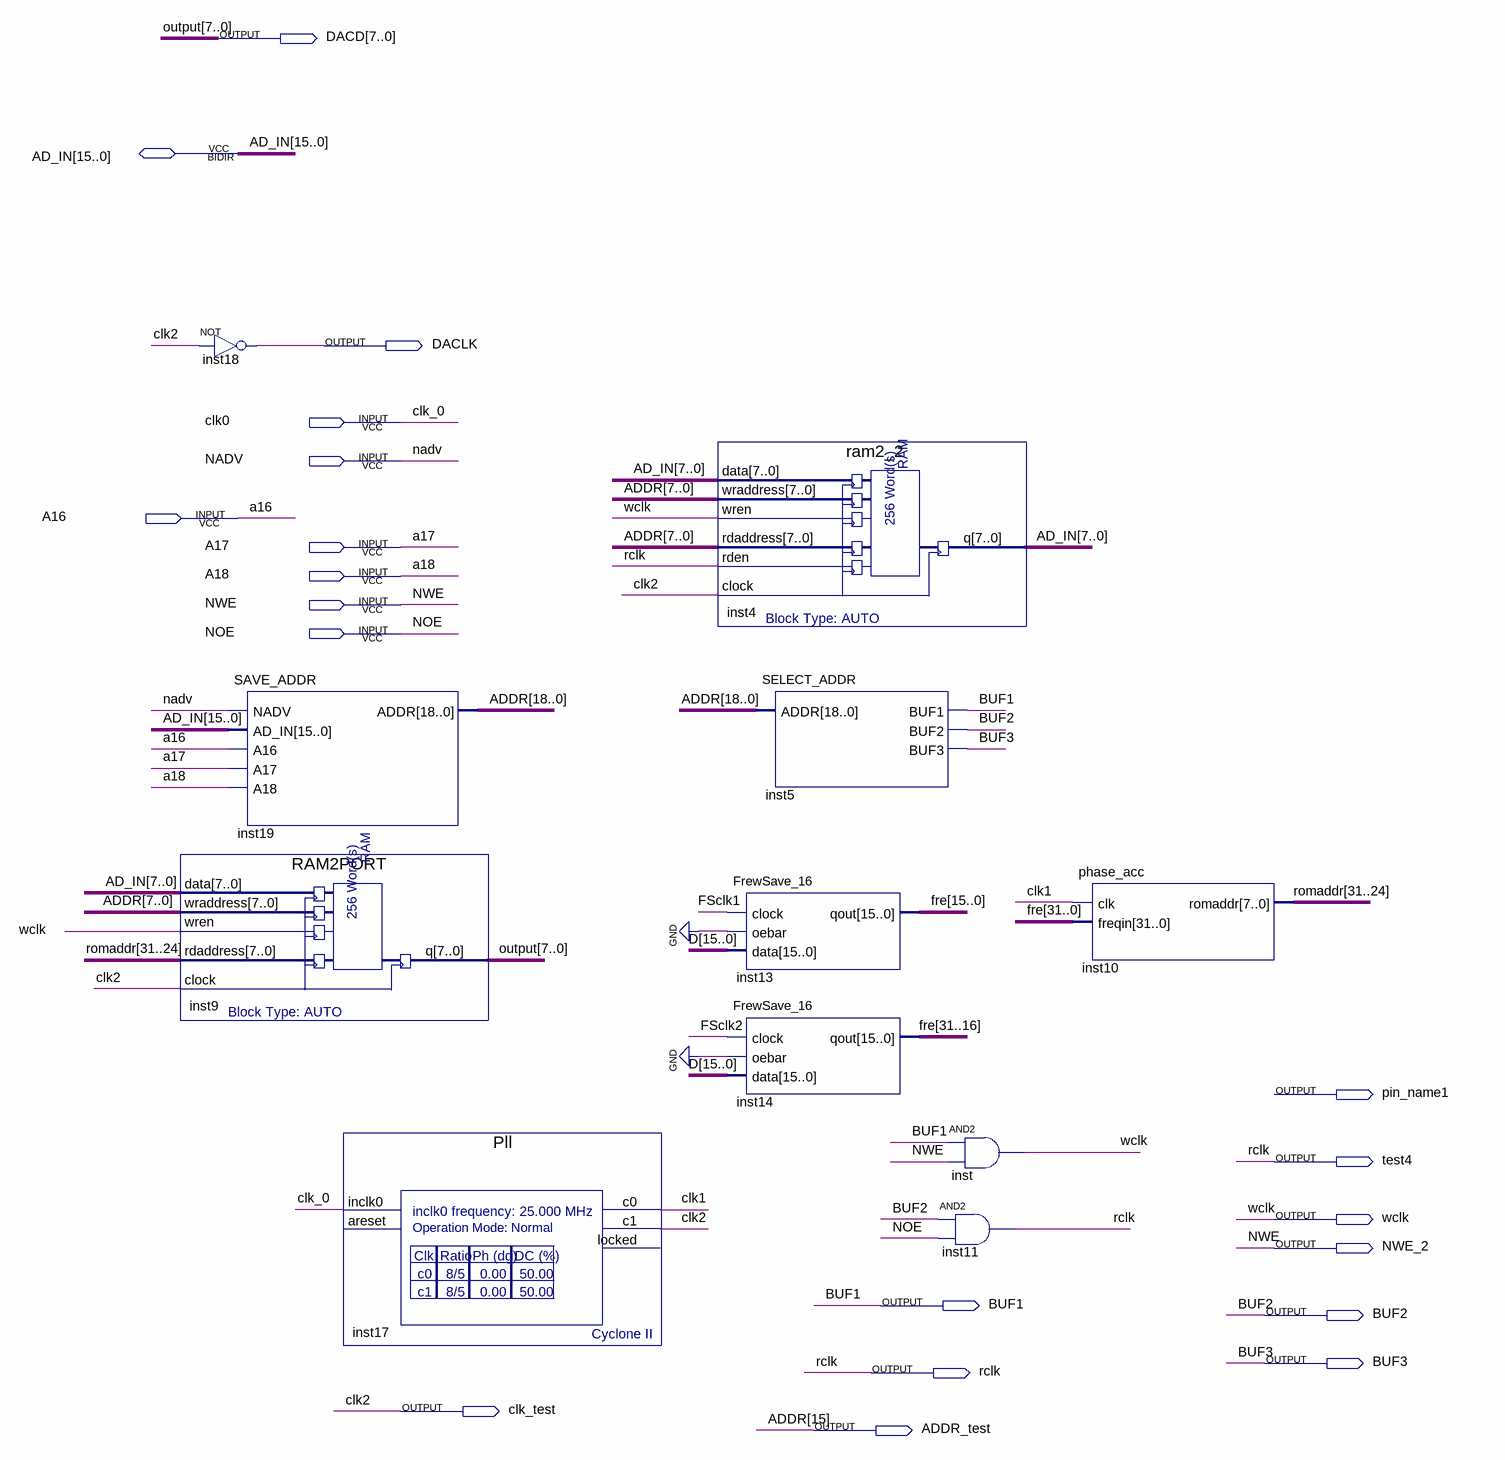
[diagram p0: schematic sheet]
// Quartus schematic dds_stm32.bdf as structural Verilog: 11 symbols, 20 pins
module dds_stm32 (
  input  clk0,
  input  NADV,
  input  A16,
  input  A17,
  input  A18,
  input  NWE,
  input  NOE,
  inout  [15:0] AD_IN,
  output [7:0] DACD,
  output DACLK,
  output pin_name1,
  output test4,
  output wclk,
  output NWE_2,
  output BUF1,
  output BUF2,
  output BUF3,
  output rclk,
  output clk_test,
  output ADDR_test
);

  wire clk1, FSclk1, FSclk2;
  wire [15:0] D;
  wire [18:0] ADDR;
  wire [31:0] fre;
  wire [31:24] romaddr;

  RAM2PORT inst9 (
    .data(AD_IN[7:0]), .wraddress(ADDR[7:0]), .wren(wclk), .rdaddress(romaddr), .clock(clk_test), .q(DACD));
  not inst18 (DACLK, clk_test);
  SAVE_ADDR inst19 (
    .NADV(NADV), .AD_IN(AD_IN), .A16(A16), .A17(A17), .A18(A18), .ADDR({ADDR[18:16], ADDR_test, ADDR[14:0]}));
  Pll inst17 (.inclk0(clk0), .c0(clk1), .c1(clk_test));  // open: areset, locked
  ram2_2 inst4 (
    .data(AD_IN[7:0]), .wraddress(ADDR[7:0]), .wren(wclk), .rdaddress(ADDR[7:0]), .rden(rclk),
    .clock(clk_test), .q(AD_IN[7:0]));
  SELECT_ADDR inst5 (.ADDR({ADDR[18:16], ADDR_test, ADDR[14:0]}), .BUF1(BUF1), .BUF2(BUF2), .BUF3(BUF3));
  FrewSave_16 inst13 (.clock(FSclk1), .oebar(1'b0), .data(D), .qout(fre[15:0]));
  FrewSave_16 inst14 (.clock(FSclk2), .oebar(1'b0), .data(D), .qout(fre[31:16]));
  and inst (wclk, BUF1, NWE);
  and inst11 (rclk, BUF2, NOE);
  phase_acc inst10 (.clk(clk1), .freqin(fre), .romaddr(romaddr));

  assign NWE_2 = NWE;
  assign test4 = rclk;

  // Other names for the same wires on the sheet: ADDR[15] = ADDR_test; clk2 = clk_test; clk_0 = clk0;
  //   output[7:0] = DACD
endmodule
